# EAGLE design untitled (EAGLE 7.4.0)
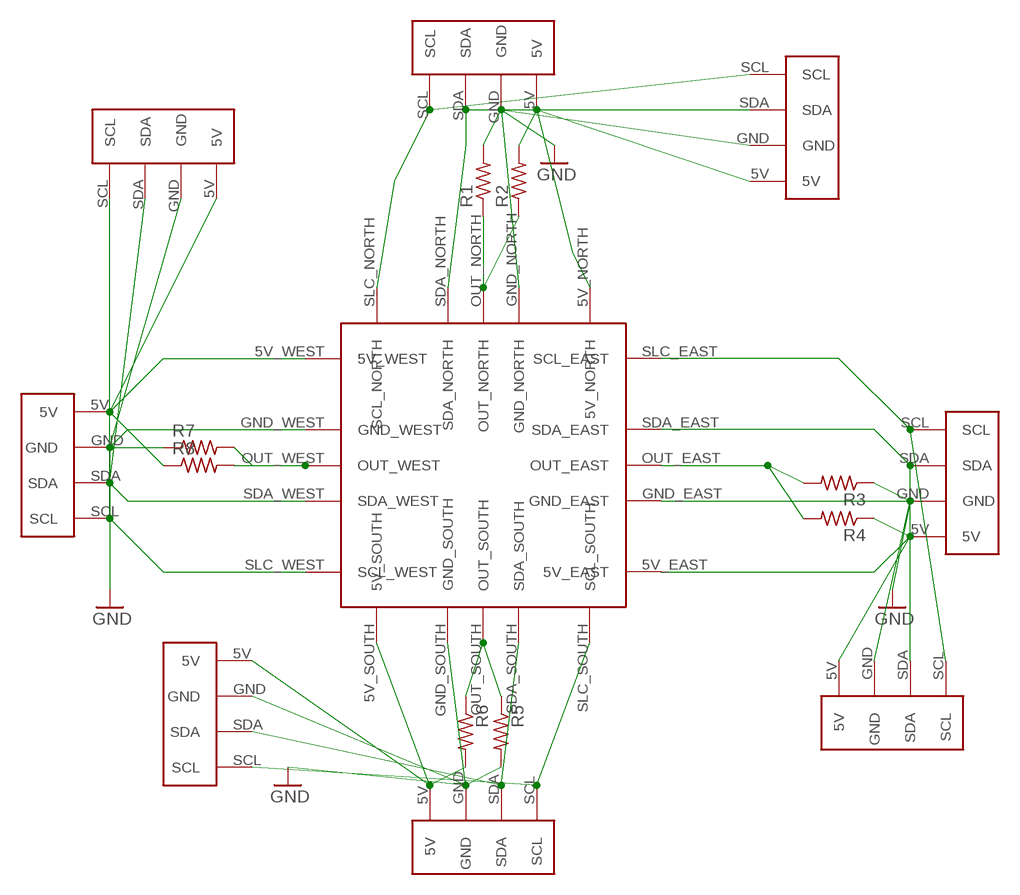
[diagram p0: schematic, sheet 1]

## Parts
CENTER1  CONNECTORS_PIN_DEVICE  [CONNECTORS_PIN]
R1  R-US_R0805  [R0805]
R2  R-US_R0805  [R0805]
R3  R-US_R0805  [R0805]
R4  R-US_R0805  [R0805]
R5  R-US_R0805  [R0805]
R6  R-US_R0805  [R0805]
R7  R-US_R0805  [R0805]
R8  R-US_R0805  [R0805]
U$1  FOUR_SIDE_PINS  [FOUR_SIDE_PINS]
U$2  FOUR_SIDE_PINS  [FOUR_SIDE_PINS]
U$3  FOUR_SIDE_PINS  [FOUR_SIDE_PINS]
U$4  FOUR_SIDE_PINS  [FOUR_SIDE_PINS]
U$5  FOUR_SIDE_PINS  [FOUR_SIDE_PINS]
U$6  FOUR_SIDE_PINS  [FOUR_SIDE_PINS]
U$7  FOUR_SIDE_PINS  [FOUR_SIDE_PINS]
U$8  FOUR_SIDE_PINS  [FOUR_SIDE_PINS]

## Nets
GND: CENTER1.GND_EAST CENTER1.GND_NORTH CENTER1.GND_SOUTH CENTER1.GND_WEST R1.2 R3.1 R5.2 R7.1 U$1.GND U$2.GND U$3.GND U$4.GND U$5.GND U$6.GND U$7.GND U$8.GND
N$1: CENTER1.5V_EAST R4.1 U$1.5V U$6.5V
N$3: CENTER1.OUT_EAST R3.2 R4.2
N$4: CENTER1.SDA_EAST U$1.SDA U$6.SDA
N$5: CENTER1.SLC_EAST(SCL_EAST) U$1.SCL U$6.SCL
N$6: CENTER1.5V_NORTH R2.2 U$2.5V U$5.5V
N$7: CENTER1.OUT_NORTH R1.1 R2.1
N$9: CENTER1.SDA_NORTH U$2.SDA U$5.SDA
N$10: CENTER1.SLC_NORTH(SCL_NORTH) U$2.SCL U$5.SCL
N$11: CENTER1.5V_WEST R8.1 U$3.5V U$8.5V
N$13: CENTER1.SDA_WEST U$3.SDA U$8.SDA
N$14: CENTER1.SLC_WEST(SCL_WEST) U$3.SCL U$8.SCL
N$15: CENTER1.OUT_WEST R7.2 R8.2
N$17: CENTER1.5V_SOUTH R6.2 U$4.5V U$7.5V
N$18: CENTER1.OUT_SOUTH R5.1 R6.1
N$19: CENTER1.SDA_SOUTH U$4.SDA U$7.SDA
N$20: CENTER1.SLC_SOUTH(SCL_SOUTH) U$4.SCL U$7.SCL

## Library data of the parts
CENTER1 = probatioBase5Pins_0.0.2:CONNECTORS_PIN_DEVICE: Bottom Contact Probatio contact for slots on the base. This version has 5 pins
R1-R8 = resistor:R-US_: RESISTOR, American symbol
U$1-U$8 = probatio_fourSidePins:FOUR_SIDE_PINS

## Board
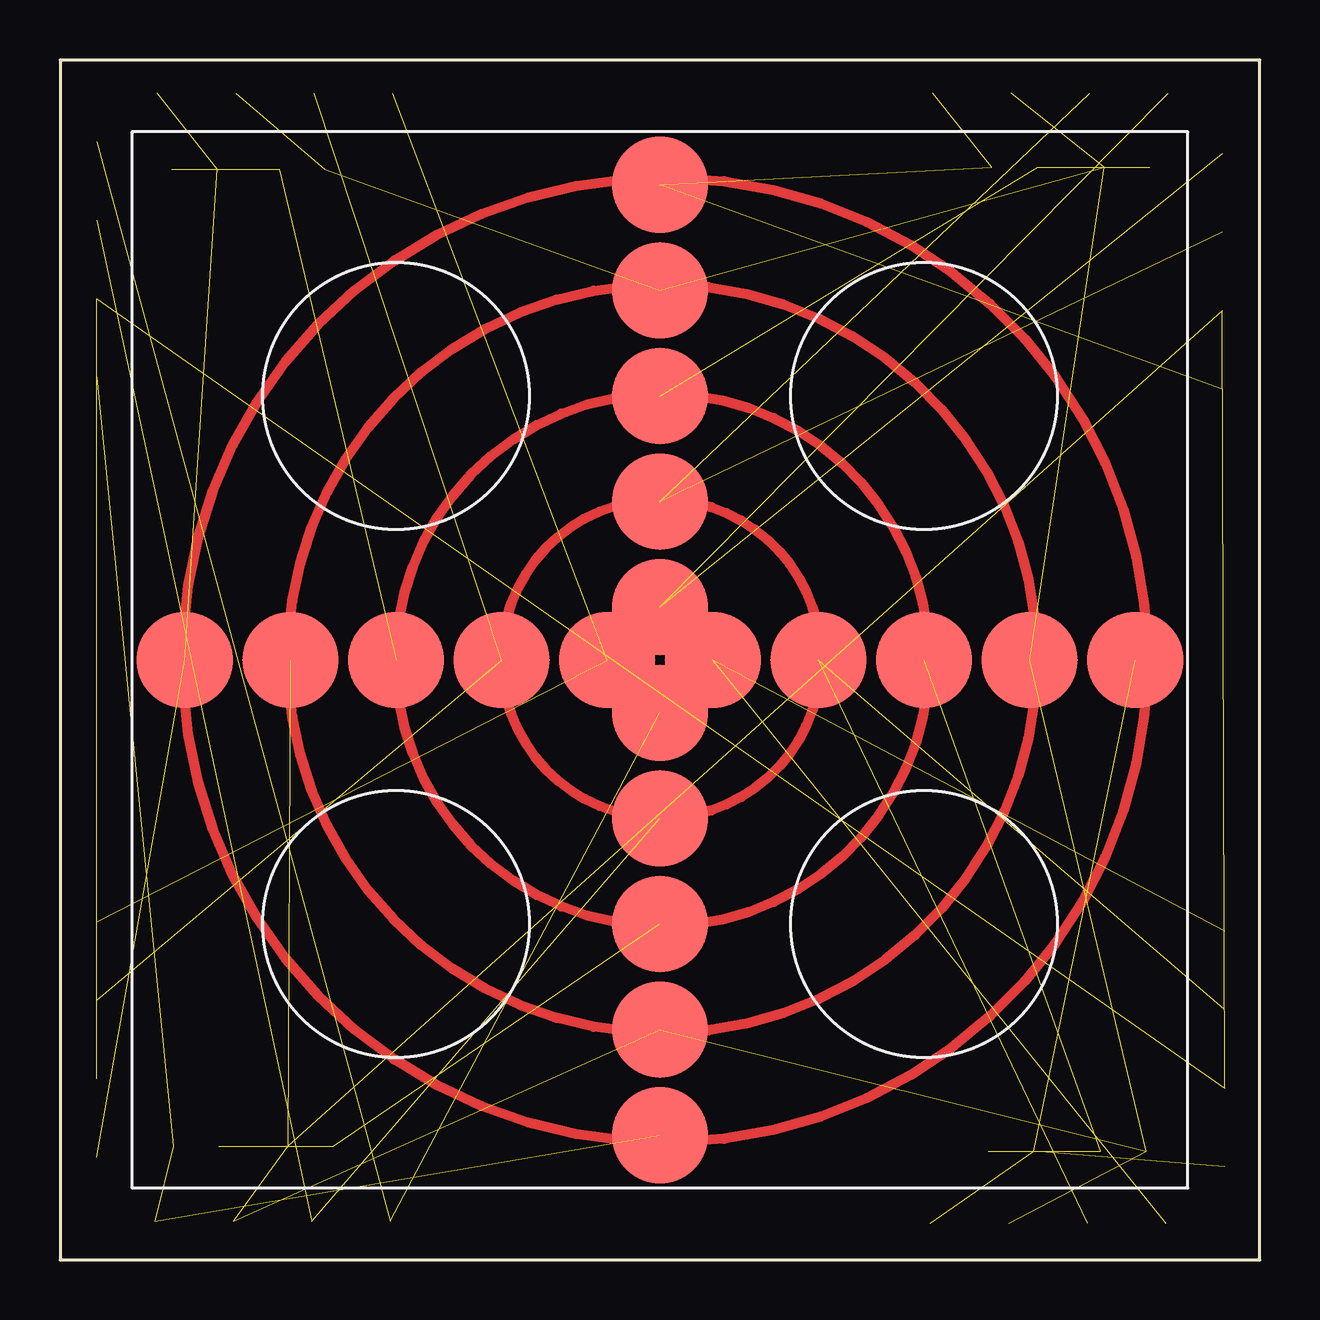
[diagram p1: board, top side]
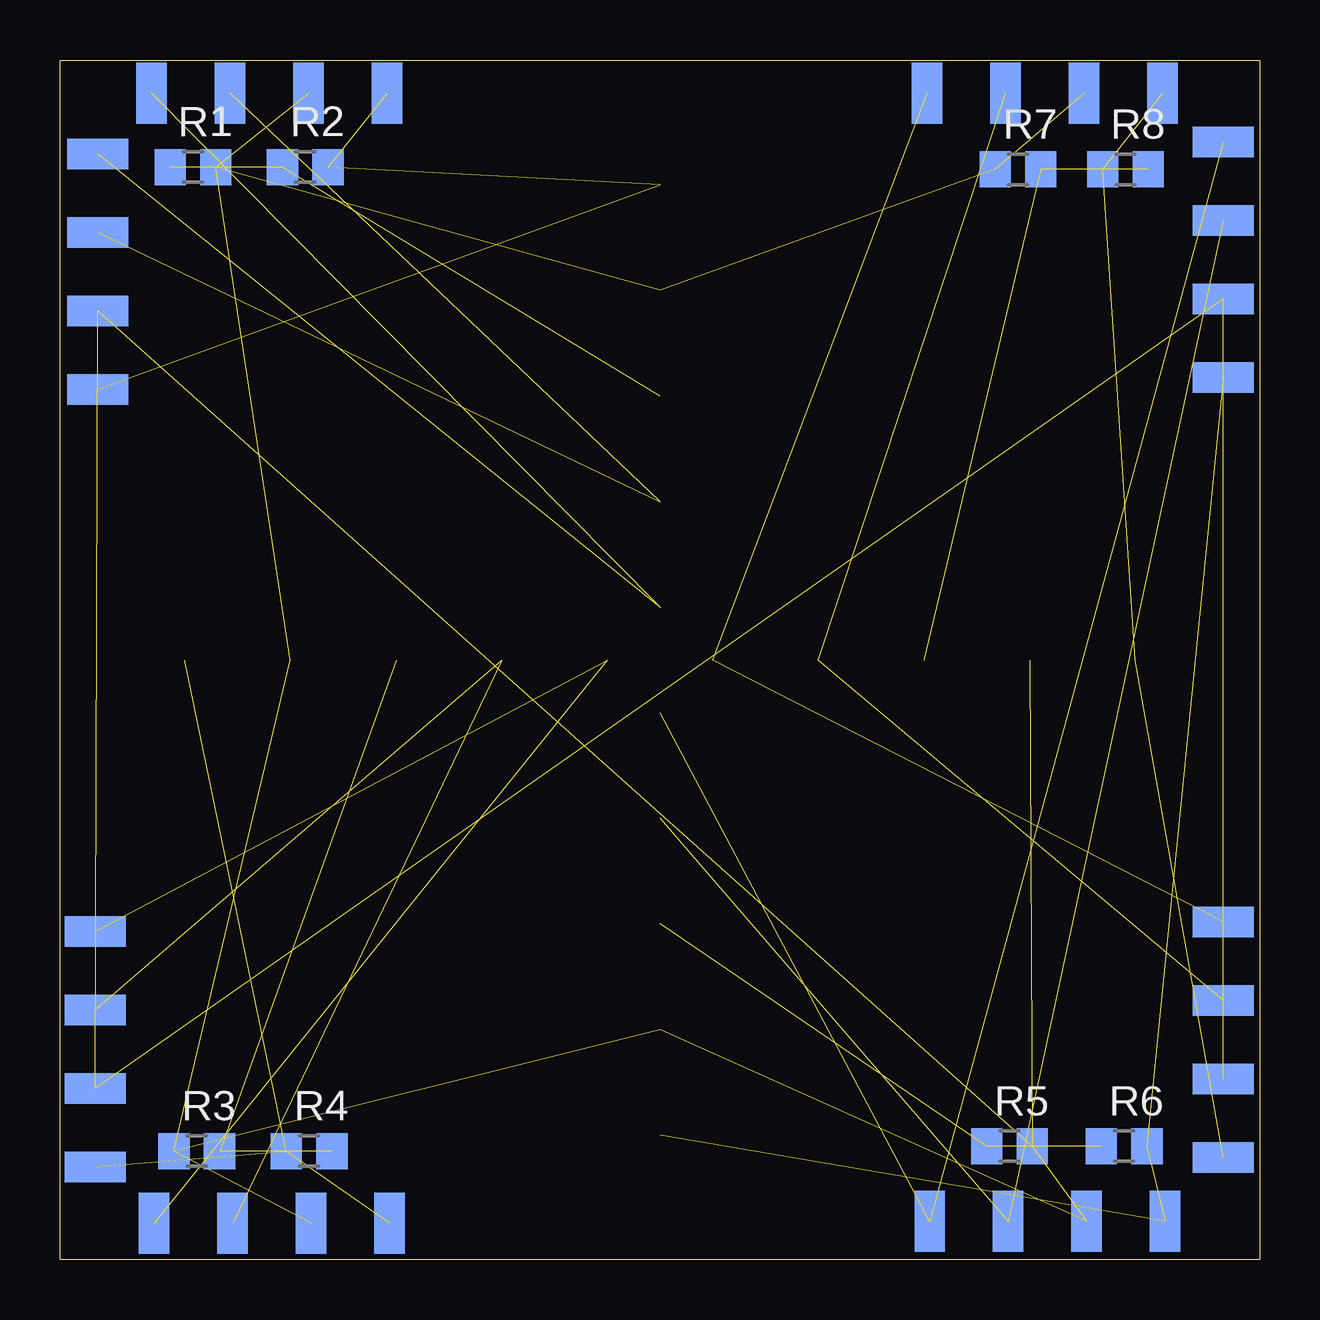
[diagram p2: board, bottom side, seen from below]

Size 50 x 50 mm. Coordinates in mm from the lower left corner, seen from the top.
Outline: 0,0 50,0 50,50 0,50 0,0
Copper layers (1*16): Top 0.035mm / dielectric 1.5mm / Bottom 0.035mm
Design rules "default": minimum track width 10mil, minimum drill 24mil, track to track 8mil, track to pad 8mil, pad to pad 8mil, via to via 8mil, smd to smd 8mil, copper to edge 40mil, drill to drill 8mil, minimum pad ring 10mil, minimum via ring 8mil, stop-mask expansion 4mil, vias tented up to drill 0mil, thermal gap 10mil

### Footprints (pad centres in the part's own frame; a part is rotated, then mirrored left to right if it is on the bottom)
CONNECTORS_PIN = smd 4 x 4: 5V_EAST 44.801,24.999; 5V_NORTH 24.999,44.801; 5V_SOUTH 24.999,5.199; 5V_WEST 5.199,24.999; GND_EAST 40.399,24.999; GND_NORTH 24.999,40.399; GND_SOUTH 24.999,9.599; GND_WEST 9.599,24.999; OUT_EAST 35.999,24.999; OUT_NORTH 24.999,35.999; OUT_SOUTH 24.999,14; OUT_WEST 14,24.999; SDA_EAST 31.6,24.999; SDA_NORTH 24.999,31.6; SDA_SOUTH 24.999,18.4; SDA_WEST 18.4,24.999; SLC_EAST 27.201,24.999; SLC_NORTH 24.999,27.201; SLC_SOUTH 24.999,22.799; SLC_WEST 22.799,24.999
R0805 = smd 1.3 x 1.5: 1 -0.95,0; 2 0.95,0
FOUR_SIDE_PINS = smd 2.54 x 1.27: 5V 1.27,1.08; GND 1.27,4.35; SCL 1.27,10.89; SDA 1.27,7.62

### Placement (x,y rotation side)
CENTER1  0,0 0 top
R1  44.46,45.54 0 bottom
R2  39.78,45.54 0 bottom
R3  44.3,4.54 0 bottom
R4  39.62,4.54 0 bottom
R5  10.44,4.74 0 bottom
R6  5.66,4.74 0 bottom
R7  10.08,45.44 0 bottom
R8  5.6,45.44 0 bottom
U$1  35.19,0.27 90 bottom
U$2  35.29,47.34 90 bottom
U$3  2.98,47.34 90 bottom
U$4  2.87,0.34 90 bottom
U$5  49.7,35.2 0 bottom
U$6  49.8,2.8 0 bottom
U$7  2.8,35.7 0 bottom
U$8  2.8,3.2 0 bottom

### Tracks (layer width: path | path; a pad name or v marks a point on that pad's centre or on a via)
GND  (15 unrouted)
N$1  (3 unrouted)
N$2
  Top 0.406: 31.7,24.9 arc-357 31.7,25.2
N$3  (2 unrouted)
N$4  (2 unrouted)
N$5  (2 unrouted)
N$6  (3 unrouted)
N$7  (2 unrouted)
N$8
  Top 0.406: 36.2,24.9 arc-359 36.2,25.1
N$9  (2 unrouted)
N$10  (2 unrouted)
N$11  (3 unrouted)
N$12
  Top 0.406: 40.7,24.9 arc-359 40.7,25.2
N$13  (2 unrouted)
N$14  (2 unrouted)
N$15  (2 unrouted)
N$16
  Top 0.406: 45.3,24.8 arc-359 45.3,25.2
N$17  (3 unrouted)
N$18  (2 unrouted)
N$19  (2 unrouted)
N$20  (2 unrouted)